# Altium schematic sheet GSM.SchDoc
size A4; SheetNumber: 3; SheetTotal: 12
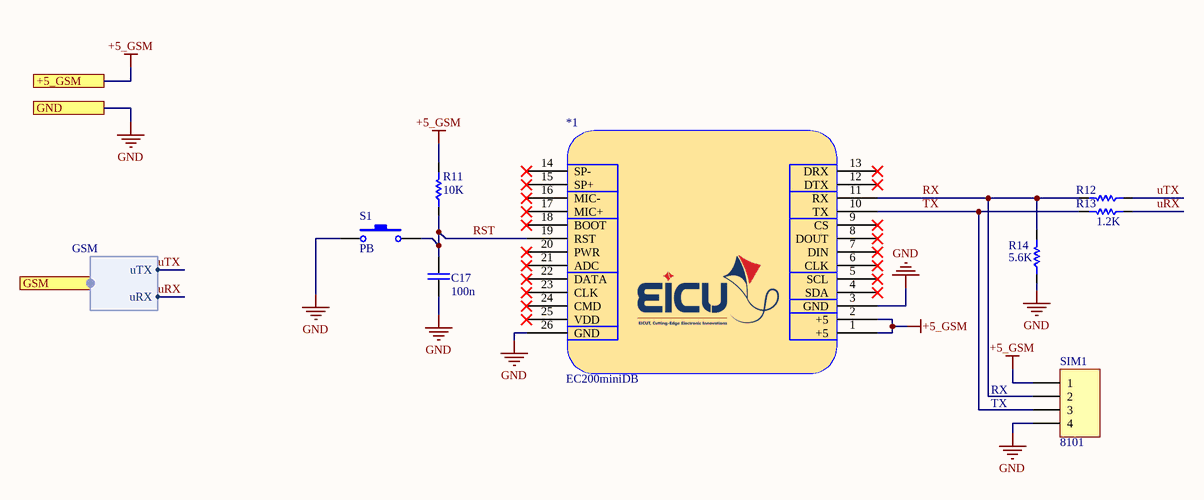
[diagram p0: GSM.SchDoc]

## Parts
*1  EC200miniDB  [PCBComponent_1]
C17  100n  [CAP 1206/3216]
R11  10K  [RES 1206 (3216X08L)]
R12  47K  [RES 1206 (3216X08L)]  (value not drawn)
R13  value 1.2K  [RES 1206 (3216X08L)]  (hidden comment: 1K)
R14  5.6K  [RES 1206 (3216X08L)]
S1  PB  [SW_PB_SMD_2PIN_SPST_6X3X2]
SIM1  Inflow: 8101  [HDR_THT_4F_2.54mm]  (hidden comment: 4)

## Ports
+5_GSM, GND, GSM (harness GSM)

## Harnesses
GSM: uTX, uRX

## Nets
+5_GSM: *1.1(+5) *1.2(+5) R11.2 SIM1.1 ; port +5_GSM
GND: *1.3(GND) *1.26(GND) C17.2 R14.1 S1.2 SIM1.4 ; port GND
RST: *1.19(RST) C17.1 R11.1 S1.1
RX: *1.11(RX) R12.2 R14.2 SIM1.2
TX: *1.10(TX) R13.2 SIM1.3
uRX: R13.1 ; port GSM.uRX
uTX: R12.1 ; port GSM.uTX

Not connected (* = marked no-connect by the designer): *1 4(SDA)* 5(SCL)* 6(CLK)* 7(DIN)* 8(DOUT)* 9(CS)* 12(DTX)* 13(DRX)* 14(SP-)* 15(SP+)* 16(MIC-)* 17(MIC+)* 18(BOOT)* 20(PWR)* 21(ADC)* 22(DATA)* 23(CLK)* 24(CMD)* 25(VDD)*

## Notes on the sheet
- RX
- TX

## Library data of the parts
*1 = EC200miniDB: EICUT.com
C17 = Cap_Multi_SMD_100nF_1206: Bipolar ceramic capacitor SMD; Type: MultiLayer; Inflow: inflow?; Rating: 50V; Validation: Valid; Package: 1206; Value: 100n
R11-R14 = Res_SMD_1206: Resistor; Inflow: inflow?; Rating: 0.25W; Validation: Valid; Package: 1206; Type: 10%
  R11: Value: 10K
  R12: Value: 47K
  R14: Value: 5.6K
S1 = SW_PushButton_2_SMD: SMT Tactile ‎Switch; Rating: 2b; Validation: Valid; Inflow: 8260; Type: Vertical; Package: SMD; Value: PB
SIM1 = Con_FPH_4x1_V_THT_2.54: Header, single row, 4 pin; Rating: Rating?; Validation: NT; Value: 4; Package: Package?; Type: Type?